# Altium schematic sheet Main.SchDoc
size A4; SheetNumber: 1; SheetTotal: 13
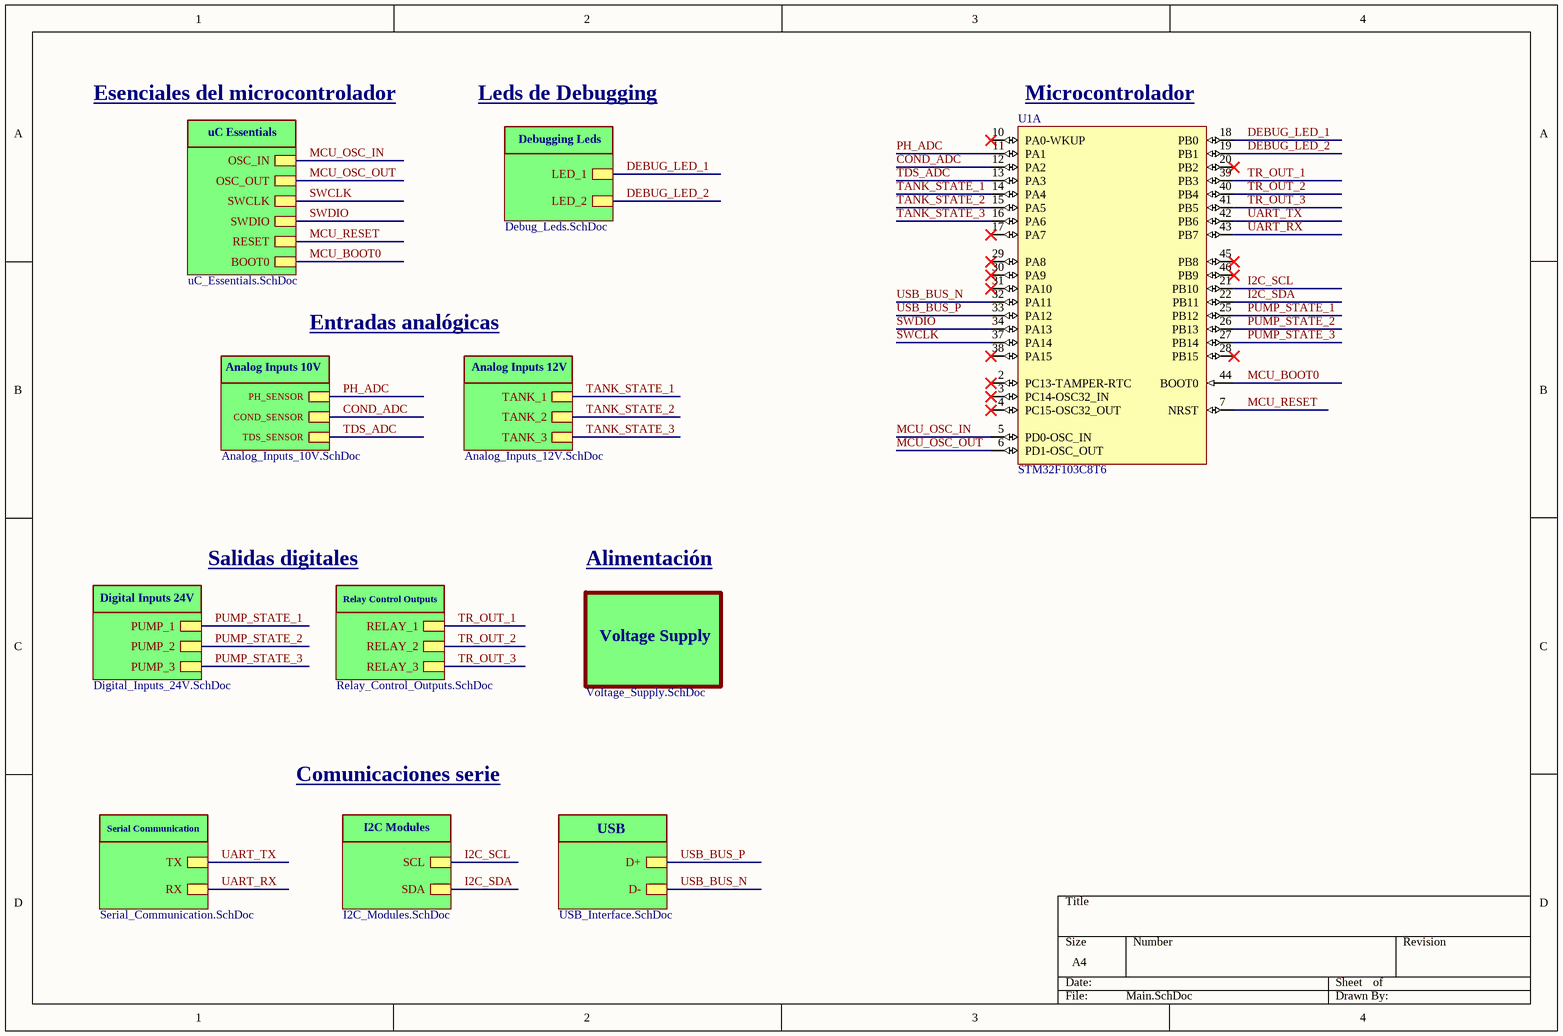
[diagram p0: Main.SchDoc]

## Parts
U1  STM32F103C8T6  [STM-LQFP48_L]  (part A of 2)

## Sub-sheets
Analog_Inputs_10V = Analog_Inputs_10V.SchDoc: PH_SENSOR, COND_SENSOR, TDS_SENSOR
Analog_Inputs_12V = Analog_Inputs_12V.SchDoc: TANK_1, TANK_2, TANK_3
Comunicacion_Serie = Serial_Communication.SchDoc: TX, RX
Debug_Leds = Debug_Leds.SchDoc: LED_1, LED_2
Digital_Inputs_24V = Digital_Inputs_24V.SchDoc: PUMP_1, PUMP_2, PUMP_3
I2C_Modules = I2C_Modules.SchDoc: SCL, SDA
Interfaz_USB = USB_Interface.SchDoc: D+, D-
Relay_Control_Outputs = Relay_Control_Outputs.SchDoc: RELAY_1, RELAY_2, RELAY_3
uC_Essentials = uC_Essentials.SchDoc: OSC_IN, OSC_OUT, SWCLK, SWDIO, RESET, BOOT0
Voltage_Supply = Voltage_Supply.SchDoc: no entries

## Nets
COND_ADC: U1.12(PA2) ; sheet Analog_Inputs_10V/COND_SENSOR
DEBUG_LED_1: U1.18(PB0) ; sheet Debug_Leds/LED_1
DEBUG_LED_2: U1.19(PB1) ; sheet Debug_Leds/LED_2
I2C_SCL: U1.21(PB10) ; sheet I2C_Modules/SCL
I2C_SDA: U1.22(PB11) ; sheet I2C_Modules/SDA
MCU_BOOT0: U1.44(BOOT0) ; sheet uC_Essentials/BOOT0
MCU_OSC_IN: U1.5(PD0-OSC_IN) ; sheet uC_Essentials/OSC_IN
MCU_OSC_OUT: U1.6(PD1-OSC_OUT) ; sheet uC_Essentials/OSC_OUT
MCU_RESET: U1.7(NRST) ; sheet uC_Essentials/RESET
PH_ADC: U1.11(PA1) ; sheet Analog_Inputs_10V/PH_SENSOR
PUMP_STATE_1: U1.25(PB12) ; sheet Digital_Inputs_24V/PUMP_1
PUMP_STATE_2: U1.26(PB13) ; sheet Digital_Inputs_24V/PUMP_2
PUMP_STATE_3: U1.27(PB14) ; sheet Digital_Inputs_24V/PUMP_3
SWCLK: U1.37(PA14) ; sheet uC_Essentials/SWCLK
SWDIO: U1.34(PA13) ; sheet uC_Essentials/SWDIO
TANK_STATE_1: U1.14(PA4) ; sheet Analog_Inputs_12V/TANK_1
TANK_STATE_2: U1.15(PA5) ; sheet Analog_Inputs_12V/TANK_2
TANK_STATE_3: U1.16(PA6) ; sheet Analog_Inputs_12V/TANK_3
TDS_ADC: U1.13(PA3) ; sheet Analog_Inputs_10V/TDS_SENSOR
TR_OUT_1: U1.39(PB3) ; sheet Relay_Control_Outputs/RELAY_1
TR_OUT_2: U1.40(PB4) ; sheet Relay_Control_Outputs/RELAY_2
TR_OUT_3: U1.41(PB5) ; sheet Relay_Control_Outputs/RELAY_3
UART_RX: U1.43(PB7) ; sheet Comunicacion_Serie/RX
UART_TX: U1.42(PB6) ; sheet Comunicacion_Serie/TX
USB_BUS_N: U1.32(PA11) ; sheet Interfaz_USB/D-
USB_BUS_P: U1.33(PA12) ; sheet Interfaz_USB/D+

Not connected (* = marked no-connect by the designer): U1 2(PC13-TAMPER-RTC)* 3(PC14-OSC32_IN)* 4(PC15-OSC32_OUT)* 10(PA0-WKUP)* 17(PA7)* 20(PB2)* 28(PB15)* 29(PA8)* 30(PA9)* 31(PA10)* 38(PA15)* 45(PB8)* 46(PB9)*

## Notes on the sheet
- Esenciales del microcontrolador
- Leds de Debugging
- (near U1) Microcontrolador
- uC Essentials
- Debugging Leds
- Analog Inputs 10V
- Entradas analógicas
- Analog Inputs 12V
- Salidas digitales
- Alimentación
- Digital Inputs 24V
- Relay Control Outputs
- Voltage Supply
- Comunicaciones serie
- Serial Communication
- I2C Modules
- USB

## Library data of the parts
U1 = CMP-0237-00215-3: ARM Cortex-M3 32-bit MCU, 64 KB Flash, 20 KB Internal RAM, 37 I/Os, 48-pin LQFP, -40 to 85 degC, Tray; Supply Voltage(Vcc) min (V): 2; Internal RAM Size (kB): 20; FLASH Size (Prog) (kB): 64; A/D Converter: 2x12-bit (10 Channel); I/Os (High Current): 37; Operating Frequency(F) (Processor speed) (MHz): 72; Core: ARM Cortex-M3; ComponentLink3Description: Package Specification; Mounting Technology: Surface Mount; PartNumber: STM32F103C8T6; PackageReference: LQFP48; Packing: Tray; ComponentLink3URL: http://www.st.com/st-web-ui/static/active/en/resource/technical/document/datasheet/DM00058181.pdf; DatasheetVersion: Rev. 16; ComponentLink1URL: http://www.st.com/web/en/home.html; PackageVersion: Rev. 6, 06/2013; ComponentLink2URL: http://www.st.com/st-web-ui/static/active/en/resource/technical/document/datasheet/CD00161566.pdf; ComponentLink1Description: Manufacturer URL; ComponentLink2Description: Datasheet; PackageDescription: 48-Pin Low Profile Quad Flat Package, 7 x 7 mm Body, 0.5 mm Pitch